# Altium schematic sheet ap-pam-v2.SchDoc: ATA Post Amplifier Module
size A; Author: Dr. Alexander Pollak; DrawnBy: Dr. Alexander Pollak; DocumentNumber: 1; Revision: 1.0; SheetNumber: 1; SheetTotal: 1
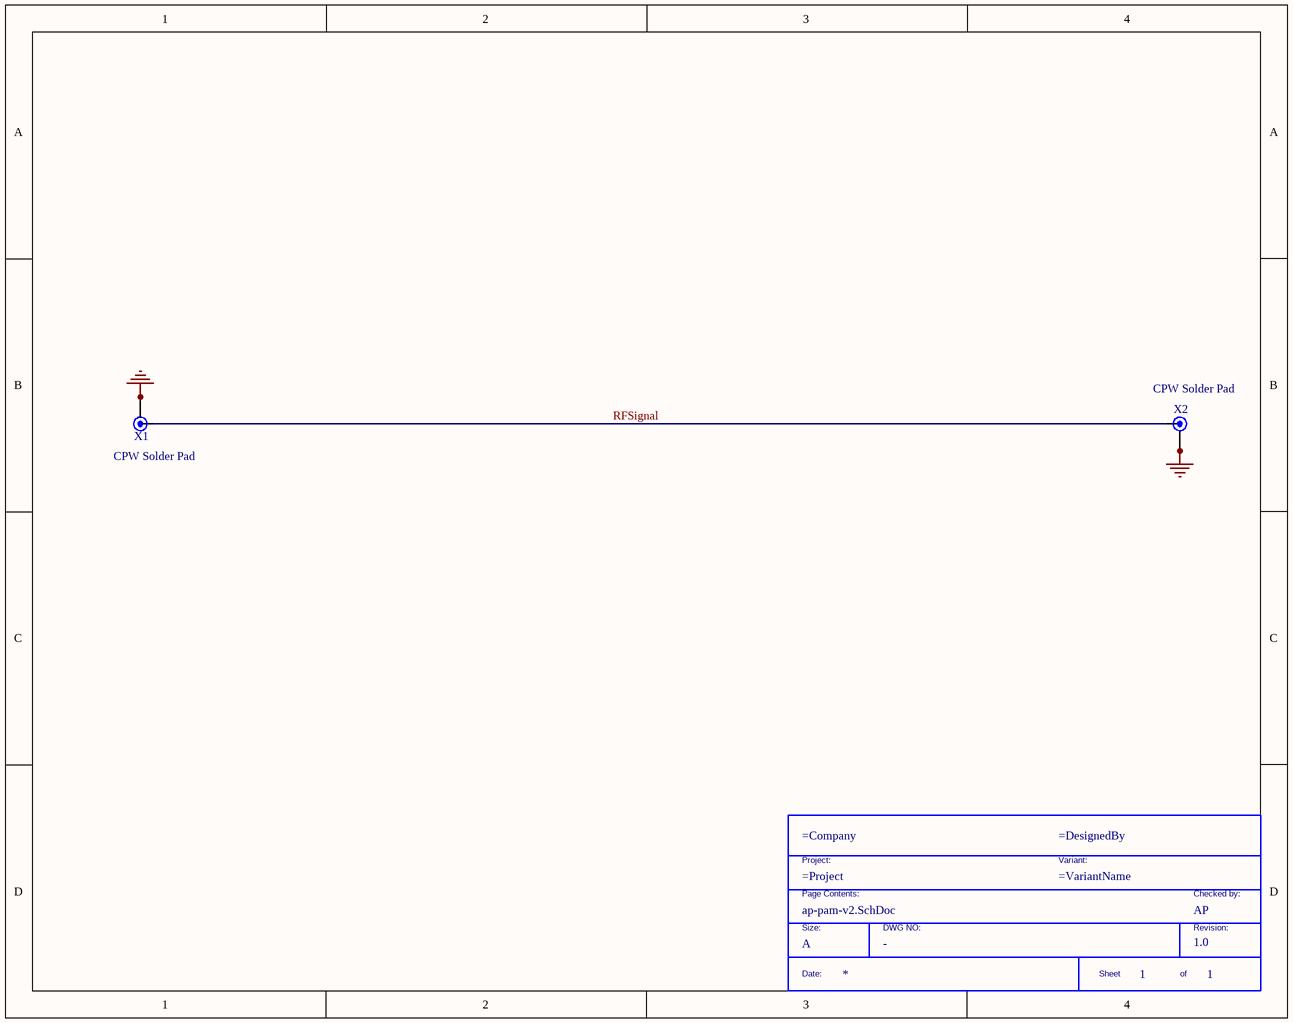
[diagram p0: ap-pam-v2.SchDoc]

## Parts
*  Size: A  Checked by: AP  (graphical)
X1  CPW Solder Pad  [CPW Edge Connector]
X2  CPW Solder Pad  [CPW Edge Connector]

## Nets
GND: X1.2 X1.3 X2.2 X2.3
RFSignal: X1.1 X2.1

## Notes on the sheet
- (in symbol TitleBlock) Project:; Variant:; Page Contents:; Checked by:; Size:; DWG NO:; Revision:; Date:; Sheet; of

## Library data of the parts
* = TitleBlock: Standard Title Block; DWG NO: -
X1 X2 = RF  CPW Solder Pad: Solder pad for RF Coplanar Waveguide Rogers 4350B Thickness 0.020" Copper 1oz